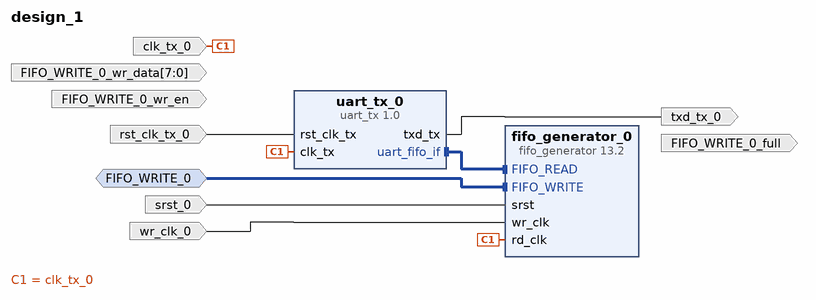
[diagram p0: block diagram of the top level]
# Vivado block design design_1, xcku035-fbva900-2-e, Vivado 2021.2
create_bd_design design_1

create_bd_intf_port -mode Slave -vlnv xilinx.com:interface:fifo_write_rtl:1.0 FIFO_WRITE_0
create_bd_port -dir I rst_clk_tx_0
create_bd_port -dir I clk_tx_0
create_bd_port -dir O txd_tx_0
create_bd_port -dir I srst_0
create_bd_port -dir I -type clk wr_clk_0
create_bd_port -dir O FIFO_WRITE_0_full
create_bd_port -dir I -from 7 -to 0 FIFO_WRITE_0_wr_data
create_bd_port -dir I FIFO_WRITE_0_wr_en

create_bd_cell -type ip -vlnv xilinxtrng.com:ip:uart_tx:1.0 uart_tx_0
set_property -dict {CONFIG.BAUD_RATE 115200 CONFIG.CLOCK_RATE 166667000} [get_bd_cells uart_tx_0]
create_bd_cell -type ip -vlnv xilinx.com:ip:fifo_generator:13.2 fifo_generator_0
set_property -dict [list \
  CONFIG.Fifo_Implementation Independent_Clocks_Builtin_FIFO \
  CONFIG.Input_Data_Width 8 \
  CONFIG.Performance_Options First_Word_Fall_Through \
  CONFIG.Read_Clock_Frequency 166 \
  CONFIG.Write_Clock_Frequency 200 \
] [get_bd_cells fifo_generator_0]

# ---- connections ----

connect_bd_intf_net -intf_net FIFO_WRITE_0_1 [get_bd_intf_ports FIFO_WRITE_0] [get_bd_intf_pins fifo_generator_0/FIFO_WRITE]
connect_bd_intf_net [get_bd_intf_pins uart_tx_0/uart_fifo_if] [get_bd_intf_pins fifo_generator_0/FIFO_READ]
connect_bd_net -net clk_tx_0_1 [get_bd_ports clk_tx_0] [get_bd_pins uart_tx_0/clk_tx] [get_bd_pins fifo_generator_0/rd_clk]
connect_bd_net -net rst_clk_tx_0_1 [get_bd_ports rst_clk_tx_0] [get_bd_pins uart_tx_0/rst_clk_tx]
connect_bd_net -net srst_0_1 [get_bd_ports srst_0] [get_bd_pins fifo_generator_0/srst]
connect_bd_net [get_bd_pins uart_tx_0/txd_tx] [get_bd_ports txd_tx_0]
connect_bd_net -net wr_clk_0_1 [get_bd_ports wr_clk_0] [get_bd_pins fifo_generator_0/wr_clk]

validate_bd_design
save_bd_design
